# Altium schematic sheet OverlayConnection.SchDoc
size A; DocumentNumber: 26; SheetNumber: 26; SheetTotal: 28
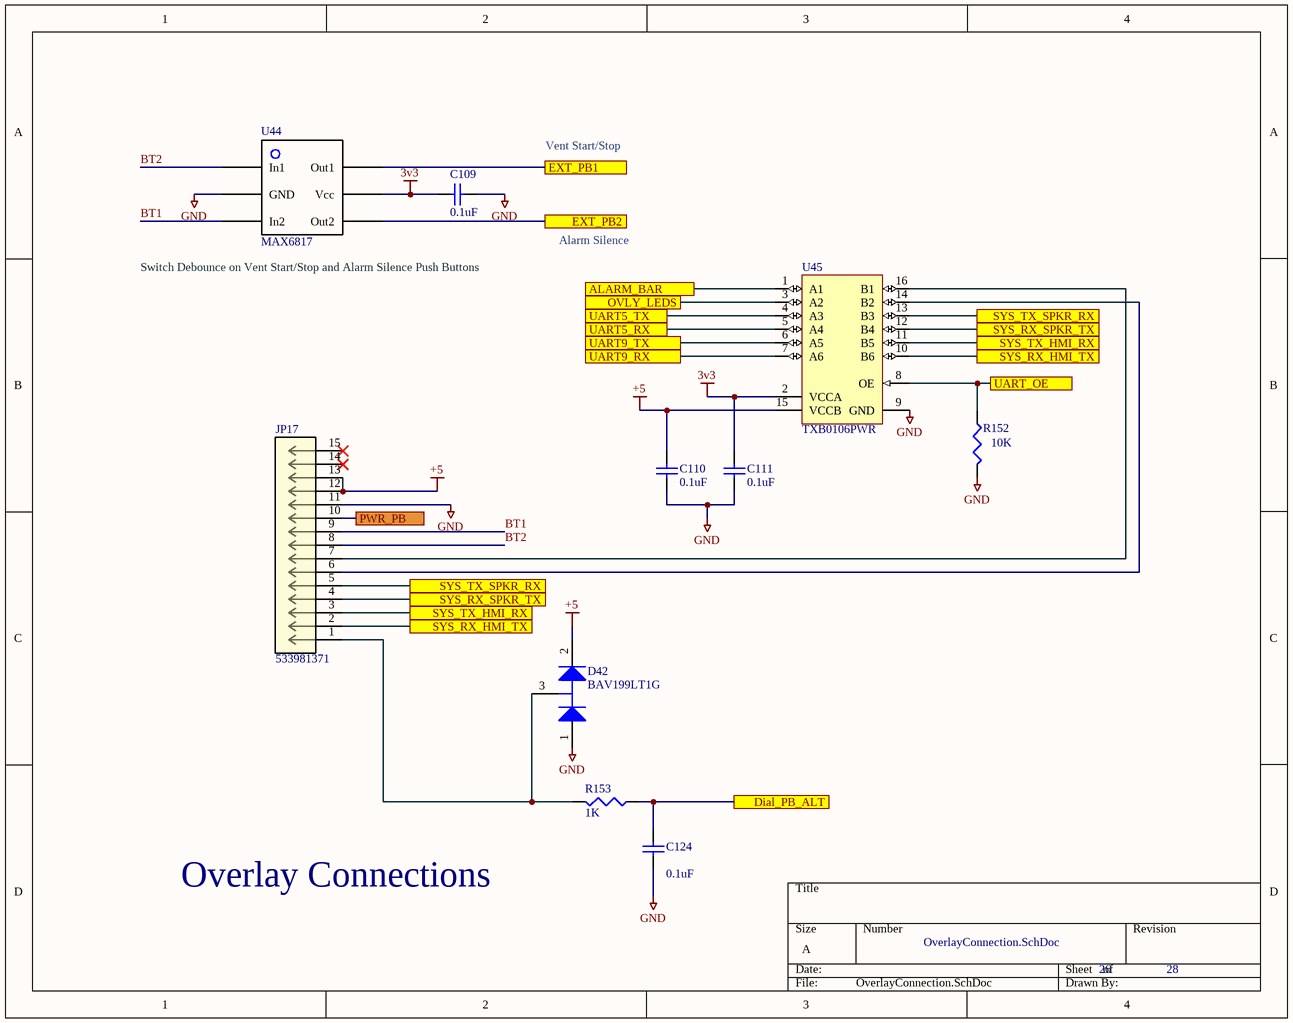
[diagram p0: OverlayConnection.SchDoc]

## Parts
C109  value 0.1uF  [J1-0603]  (hidden comment: Cap Semi)
C110  value 0.1uF  [J1-0603]  (hidden comment: Cap Semi)
C111  value 0.1uF  [J1-0603]  (hidden comment: Cap Semi)
C124  value 0.1uF  [J1-0603]  (hidden comment: Cap Semi)
D42  BAV199LT1G  [ONSC-SOT-23-3-318-08_V]
JP17  533981371  [533981371]
R152  10K  [J1-0603]
R153  value 1K  [J1-0603]  (hidden comment: Res3)
U44  MAX6817  [SOT23-6]
U45  TXB0106PWR  [PW0016A_L]

## Ports
ALARM_BAR, Dial_PB_ALT, EXT_PB1, EXT_PB2, OVLY_LEDS, PWR_PB, SYS_RX_HMI_TX, SYS_RX_SPKR_TX, SYS_TX_HMI_RX, SYS_TX_SPKR_RX, UART5_RX, UART5_TX, UART9_RX, UART9_TX, UART_OE

## Nets
3v3: C109.2 C111.1 U44.5(Vcc) U45.2(VCCA)
+5: C110.1 D42.2(K) JP17.12 JP17.13 U45.15(VCCB)
GND: C109.1 C110.2 C111.2 C124.1 D42.1(A) JP17.11 R152.2 U44.2(GND) U45.9(GND)
ALARM_BAR: U45.1(A1) ; port ALARM_BAR
BT1: JP17.9 U44.3(In2)
BT2: JP17.8 U44.1(In1)
Dial_PB_ALT: C124.2 R153.1 ; port Dial_PB_ALT
EXT_PB1: U44.6(Out1) ; port EXT_PB1
EXT_PB2: U44.4(Out2) ; port EXT_PB2
OVLY_LEDS: U45.3(A2) ; port OVLY_LEDS
PWR_PB: JP17.10 ; port PWR_PB
SYS_RX_HMI_TX: JP17.2 U45.10(B6) ; port SYS_RX_HMI_TX
SYS_RX_SPKR_TX: JP17.4 U45.12(B4) ; port SYS_RX_SPKR_TX
SYS_TX_HMI_RX: JP17.3 U45.11(B5) ; port SYS_TX_HMI_RX
SYS_TX_SPKR_RX: JP17.5 U45.13(B3) ; port SYS_TX_SPKR_RX
UART5_RX: U45.5(A4) ; port UART5_RX
UART5_TX: U45.4(A3) ; port UART5_TX
UART9_RX: U45.7(A6) ; port UART9_RX
UART9_TX: U45.6(A5) ; port UART9_TX
UART_OE: R152.1 U45.8(OE) ; port UART_OE
NetD42_3: D42.3(K/A) JP17.1 R153.2
NetJP17_6: JP17.6 U45.14(B2)
NetJP17_7: JP17.7 U45.16(B1)

Not connected (* = marked no-connect by the designer): JP17 14* 15*

## Notes on the sheet
- Vent Start/Stop
- (near U44) Switch Debounce on Vent Start/Stop and Alarm Silence Push Buttons
- Alarm Silence
- Overlay Connections

## Library data of the parts
C109-C111 C124 = Cap Semi: Capacitor (Semiconductor SIM Model); PartNumber: CL10F104ZO8NNNC; Manufacturer: Samsung; PartDescription: CAP CER 0.1UF 16V Y5V 0603; Published: 8-Jun-2000; LatestRevisionDate: 29-May-2009; LatestRevisionNote: IPC-7351 Footprint Added.; Publisher: Altium Limited; PackageDescription: Chip Capacitor; Supplier 1: Digi-Key; Supplier Part Number 1: 1276-1258-1-ND; Package Type: 0603
  C109-C111: PackageReference: C1206
  C124: PackageReference: J1-0603
D42 = CMP-1054-00087-1: Dual Series Switching Diodes, 3-Pin SOT-23, Pb-Free, Tape and Reel; Manufacturer: On Semiconductor; PartDescription: DIODE ARRAY GP 70V 215MA SOT23-3; IF Max (A): 0.215; trr Max (ns): 3000; PartNumber: BAV199LT1G; RoHS: TRUE; ComponentLink1Description: Manufacturer URL; ComponentLink2URL: http://www.onsemi.com/pub_link/Collateral/BAV199LT1-D.PDF; Mounting Technology: Surface Mount; ComponentLink2Description: Datasheet; ComponentLink3Description: Package Specification; PackageReference: SOT-23-3-318-08; PackageVersion: Rev. AP, 11/2009; Packing: Tape and Reel; DatasheetVersion: Rev. 8; Configuration: Dual Series; ComponentLink1URL: http://www.onsemi.com/; ComponentLink3URL: http://www.onsemi.cn/pub_link/Collateral/318-08.PDF; PackageDescription: 3-Pin Small Outline Transistor, Body 2.92 x 1.3 mm, Pitch 0.95 mm; Package Type: SOT23-3; Parameter 3: *
JP17 = 533981371: No Description Available; PartNumber: 0533981371; Manufacturer: Molex; PartDescription: CONN HEADER SMD 13POS 1.25MM; Vendor: Molex Connector Corporation; Built_By: Molex_Team; SourceLibrary: Add_to_database_2021-02-22; Manufacturer_Part_Number: 533981371; Copyright: Copyright (C) 2018 Accelerated Designs. All rights reserved; RefDes: RefDes; Type: DEV; Package Type: 13 SMD; Supplier 1: Digi-Key; Supplier Part Number 1: WM7617CT-ND
R152 = Res3: Resistor; PartNumber: RC0603JR-0710KL; Manufacturer: Yageo; PartDescription: RES SMD 10K OHM 5% 1/10W 0603; Published: 8-Jun-2000; LatestRevisionDate: 29-May-2009; LatestRevisionNote: IPC-7351 Footprint Added.; PackageReference: J1-0603; Publisher: Altium Limited; PackageDescription: Chip Resistor; Value: 10K; Package Type: 0603
R153 = Res3: Resistor; PartNumber: RC0603JR-071KL; Manufacturer: Yageo; PartDescription: RES SMD 1K OHM 5% 1/10W 0603; Published: 8-Jun-2000; LatestRevisionDate: 29-May-2009; LatestRevisionNote: IPC-7351 Footprint Added.; PackageReference: J1-0603; Publisher: Altium Limited; PackageDescription: Chip Resistor; Supplier 1: Digi-Key; Supplier Part Number 1: 311-1.0KGRCT-ND; Package Type: 0603
U44 = MAX6817: PartNumber: MAX6817EUT+T; Manufacturer: Maxim Integrated; PartDescription: IC INTERFACE SPECIALIZED SOT23-6; Package Type: SOT 23-6; Supplier 1: Digi-Key; Supplier Part Number 1: MAX6817EUT+TCT-ND
U45 = CMP-2000-07336-1: 6-Bit Bidirectional Level-Shifting and Voltage Translator with Auto-Direction Sensing and +/- 15-kV ESD Protection, 1.2 to 3.6 V, -40 to 85 degC, 16-Pin TSSOP (PW), Green (RoHS & no Sb/Br), Tape and Reel; Manufacturer: Texas Instruments; PartDescription: IC TRNSLTR BIDIRECTIONAL 16TSSOP; Dynamic Catalog: TXBSeries; Differential - Input: Output:No/No; Number of Bits: 6; Output Type: Logic; Propagation Delay (Max): 4ns; Number of Outputs/Channel: 1; Voltage - Supply: 1.2V~3.6V,1.65V~5.5V; Data Rate: 100Mbps; Product Training Modules: VoltageLevelTranslation; Other Names: 296-23759-1; Logic Function: Translator,Bidirectional; Packaging: CutTape(CT); Datasheet URL: http://www.ti.com/general/docs/lit/getliterature.tsp?genericPartNumber=TXB0106&fileType=pdf; Package Description: 16-Pin Small Outline Package Integrated Circuit, Body 5 x 4.4 mm, Pitch 0.65 mm; Standard Package: 1; Series: -; Manufacturer URL: http://www.ti.com/; Operating Temperature: -40°C~85°C; Supplier Device Package: 16-TSSOP; Package Reference: PW16; Number of Channels: 6; Category: IntegratedCircuits(ICs); Package / Case: 16-TSSOP(0.173",4.40mmWidth); Family: Logic-Translators; Datasheet Version: Rev. B, 06/2015; Mounting Technology: SurfaceMount; Input Type: Logic; Supplier 1: Digi-Key; Supplier Part Number 1: 296-23759-1-ND; PartNumber: TXB0106PWR; Package Type: 16 TSSOP